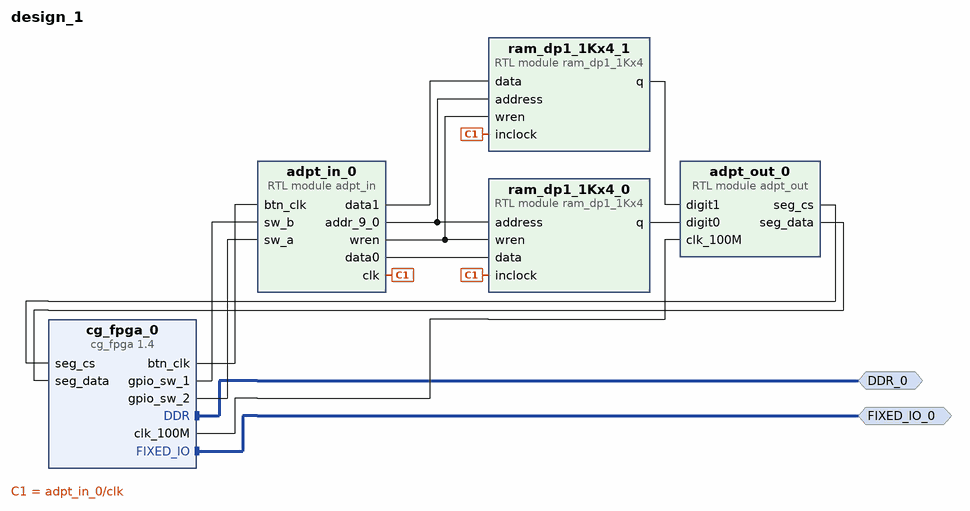
[diagram p0: block diagram of the top level]
# Vivado block design design_1, xc7z020clg400-1, Vivado 2024.2
create_bd_design design_1

create_bd_intf_port -mode Master -vlnv xilinx.com:display_processing_system7:fixedio_rtl:1.0 FIXED_IO_0
create_bd_intf_port -mode Master -vlnv xilinx.com:interface:ddrx_rtl:1.0 DDR_0

create_bd_cell -type ip -vlnv educg.net:user:cg_fpga:1.4 cg_fpga_0
create_bd_cell -type module -reference adpt_in adpt_in_0
create_bd_cell -type module -reference adpt_out adpt_out_0
create_bd_cell -type module -reference ram_dp1_1Kx4 ram_dp1_1Kx4_0
create_bd_cell -type module -reference ram_dp1_1Kx4 ram_dp1_1Kx4_1

# ---- connections ----

connect_bd_intf_net [get_bd_intf_ports DDR_0] [get_bd_intf_pins cg_fpga_0/DDR]
connect_bd_intf_net [get_bd_intf_ports FIXED_IO_0] [get_bd_intf_pins cg_fpga_0/FIXED_IO]
connect_bd_net [get_bd_pins adpt_in_0/addr_9_0] [get_bd_pins ram_dp1_1Kx4_1/address] [get_bd_pins ram_dp1_1Kx4_0/address]
connect_bd_net [get_bd_pins adpt_in_0/clk] [get_bd_pins ram_dp1_1Kx4_1/inclock] [get_bd_pins ram_dp1_1Kx4_0/inclock]
connect_bd_net [get_bd_pins adpt_in_0/data0] [get_bd_pins ram_dp1_1Kx4_0/data]
connect_bd_net [get_bd_pins adpt_in_0/data1] [get_bd_pins ram_dp1_1Kx4_1/data]
connect_bd_net [get_bd_pins adpt_in_0/wren] [get_bd_pins ram_dp1_1Kx4_1/wren] [get_bd_pins ram_dp1_1Kx4_0/wren]
connect_bd_net [get_bd_pins adpt_out_0/seg_cs] [get_bd_pins cg_fpga_0/seg_cs]
connect_bd_net [get_bd_pins adpt_out_0/seg_data] [get_bd_pins cg_fpga_0/seg_data]
connect_bd_net [get_bd_pins cg_fpga_0/btn_clk] [get_bd_pins adpt_in_0/btn_clk]
connect_bd_net [get_bd_pins cg_fpga_0/clk_100M] [get_bd_pins adpt_out_0/clk_100M]
connect_bd_net [get_bd_pins cg_fpga_0/gpio_sw_1] [get_bd_pins adpt_in_0/sw_b]
connect_bd_net [get_bd_pins cg_fpga_0/gpio_sw_2] [get_bd_pins adpt_in_0/sw_a]
connect_bd_net [get_bd_pins ram_dp1_1Kx4_0/q] [get_bd_pins adpt_out_0/digit0]
connect_bd_net [get_bd_pins ram_dp1_1Kx4_1/q] [get_bd_pins adpt_out_0/digit1]

validate_bd_design
save_bd_design
